# EAGLE design BB-cape-mitered-0603 (EAGLE 6.4)
DATABASE: ./../BOM/logic-supply-db.txt
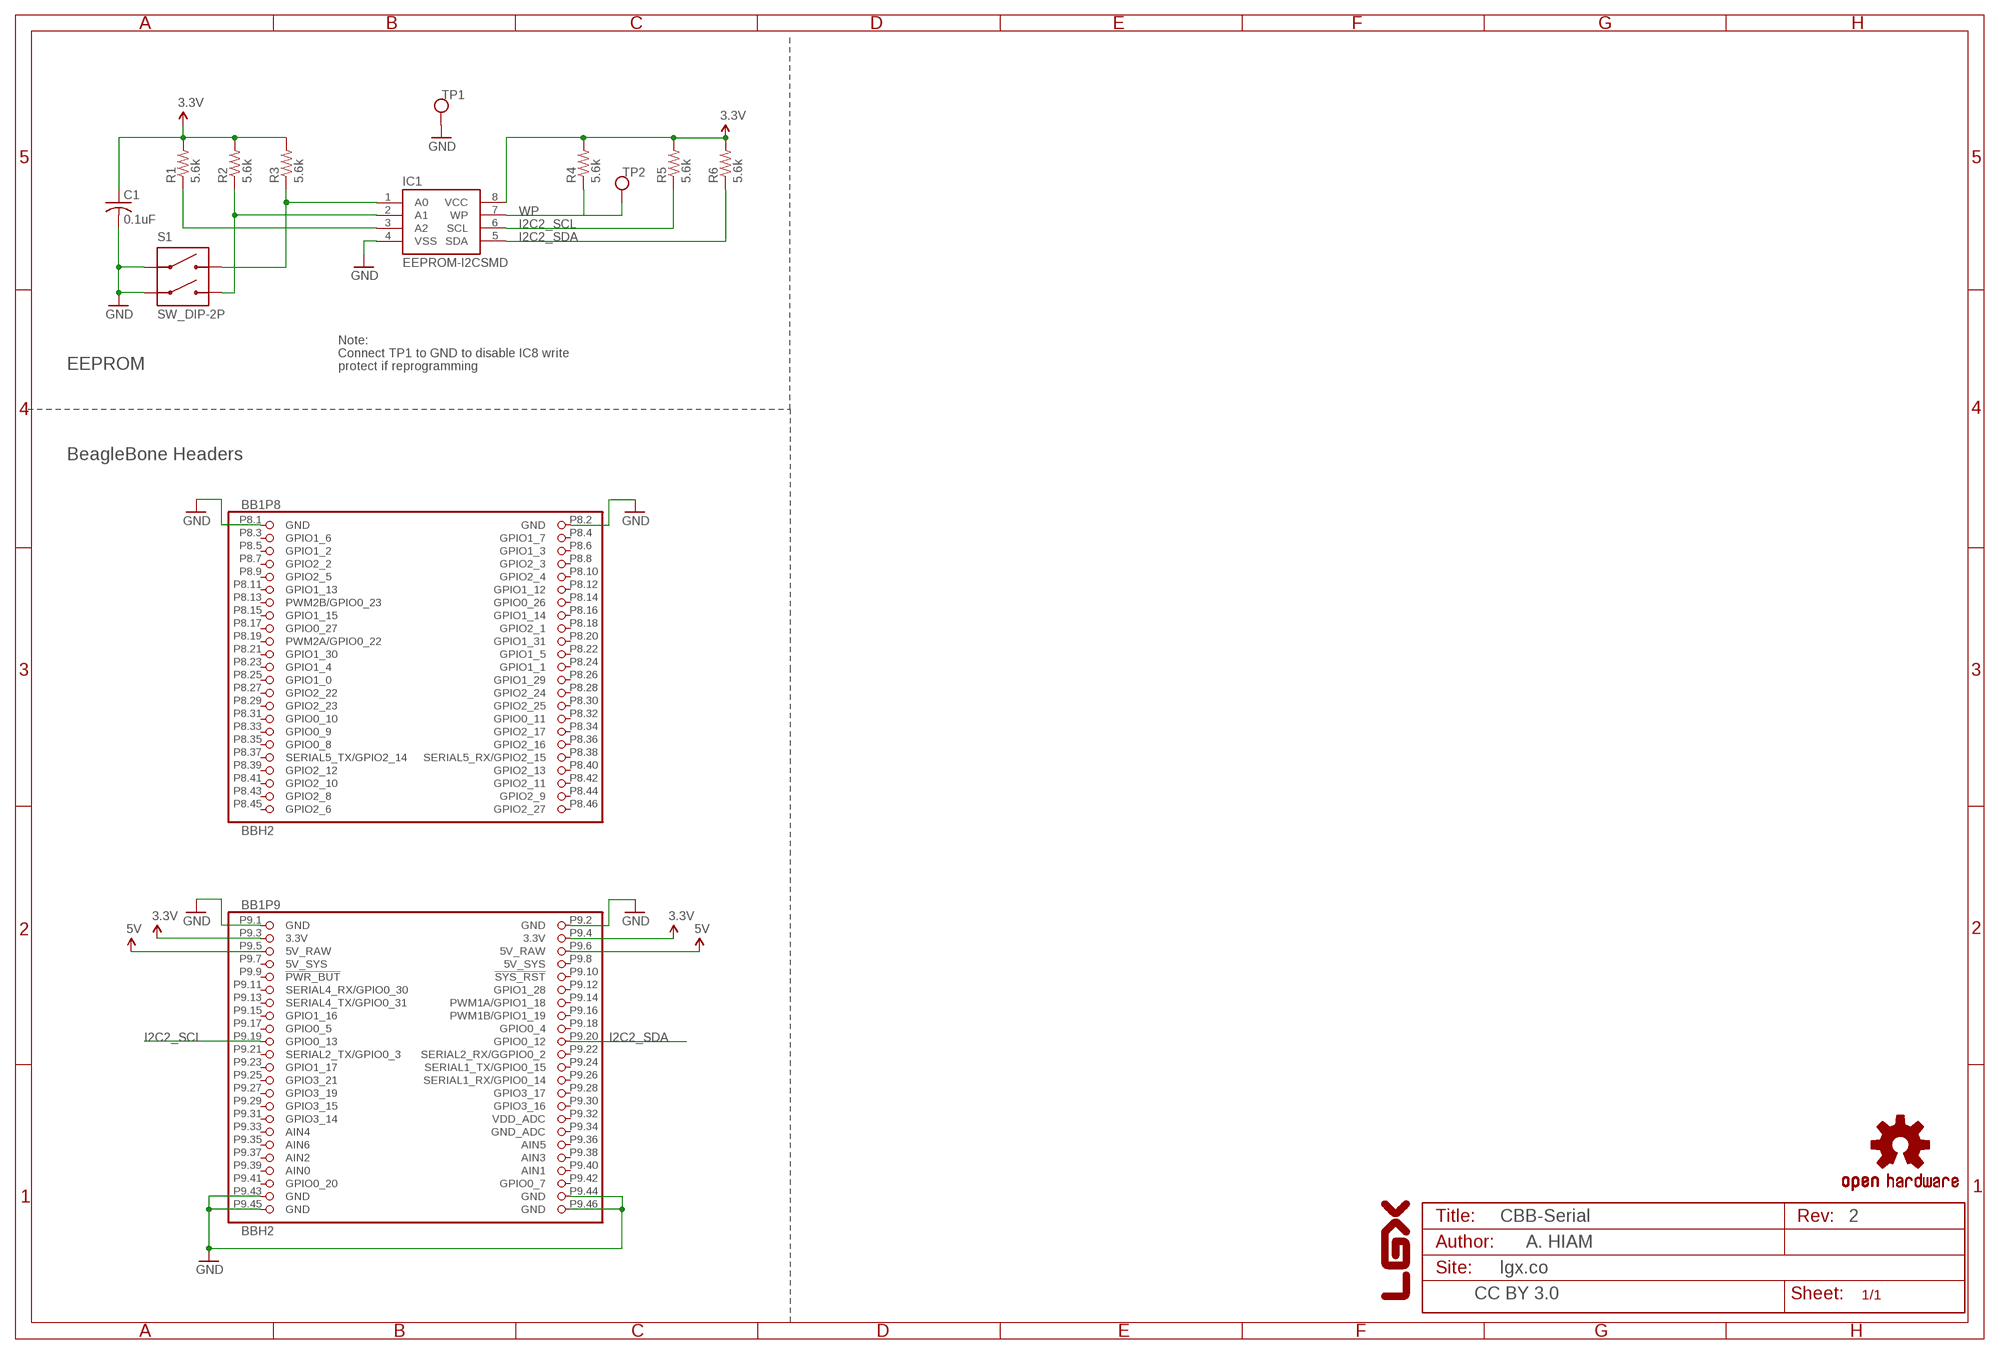
[diagram p0: schematic, sheet 1]

## Parts
BB1  BBH2  [BB_CAPE_TOP]
C1  0.1uF  C-USC0603  [C0603]
IC1  EEPROM-I2CSMD  [SO08]
R1  5.6k  R-US_R0603  [R0603]
R2  5.6k  R-US_R0603  [R0603]
R3  5.6k  R-US_R0603  [R0603]
R4  5.6k  R-US_R0603  [R0603]
R5  5.6k  R-US_R0603  [R0603]
R6  5.6k  R-US_R0603  [R0603]
S1  SW_DIP-2P  [DIPSWITCH-2P-SMD-1.27]
TP1  TEST_POINT  [TEST_POINT]
TP2  TEST_POINT  [TEST_POINT]
U$4  LOGO-LGX_LARGE  [LOGO-LGX-LARGE]
U$7  OSHW-LOGOM  [OSHW-LOGO-M]

## Nets
3.3V: BB1.P9.3(P9:3.3V) BB1.P9.4(P9:3.3V) C1.1 IC1.8(VCC) R1.2 R2.2 R3.2 R4.2 R5.2 R6.2
5V: BB1.P9.5(P9:5V_RAW) BB1.P9.6(P9:5V_RAW)
GND: BB1.P8.1(P8:GND) BB1.P8.2(P8:GND) BB1.P9.1(P9:GND) BB1.P9.2(P9:GND) BB1.P9.43(P9:GND) BB1.P9.44(P9:GND) BB1.P9.45(P9:GND) BB1.P9.46(P9:GND) C1.2 IC1.4(VSS) S1.1A S1.2A TP1.P$1
I2C2_SCL: BB1.P9.19(P9:GPIO0_13) IC1.6(SCL) R5.1
I2C2_SDA: BB1.P9.20(P9:GPIO0_12) IC1.5(SDA) R6.1
N$13: IC1.1(A0) R3.1 S1.1B
N$14: IC1.2(A1) R2.1 S1.2B
N$15: IC1.3(A2) R1.1
WP: IC1.7(WP) R4.1 TP2.P$1
Unconnected: BB1.P8.3(P8:GPIO1_6) BB1.P8.4(P8:GPIO1_7) BB1.P8.5(P8:GPIO1_2) BB1.P8.6(P8:GPIO1_3) BB1.P8.7(P8:GPIO2_2) BB1.P8.8(P8:GPIO2_3) BB1.P8.9(P8:GPIO2_5) BB1.P8.10(P8:GPIO2_4) BB1.P8.11(P8:GPIO1_13) BB1.P8.12(P8:GPIO1_12) BB1.P8.13(P8:PWM2B/GPIO0_23) BB1.P8.14(P8:GPIO0_26) BB1.P8.15(P8:GPIO1_15) BB1.P8.16(P8:GPIO1_14) BB1.P8.17(P8:GPIO0_27) BB1.P8.18(P8:GPIO2_1) BB1.P8.19(P8:PWM2A/GPIO0_22) BB1.P8.20(P8:GPIO1_31) BB1.P8.21(P8:GPIO1_30) BB1.P8.22(P8:GPIO1_5) BB1.P8.23(P8:GPIO1_4) BB1.P8.24(P8:GPIO1_1) BB1.P8.25(P8:GPIO1_0) BB1.P8.26(P8:GPIO1_29) BB1.P8.27(P8:GPIO2_22) BB1.P8.28(P8:GPIO2_24) BB1.P8.29(P8:GPIO2_23) BB1.P8.30(P8:GPIO2_25) BB1.P8.31(P8:GPIO0_10) BB1.P8.32(P8:GPIO0_11) BB1.P8.33(P8:GPIO0_9) BB1.P8.34(P8:GPIO2_17) BB1.P8.35(P8:GPIO0_8) BB1.P8.36(P8:GPIO2_16) BB1.P8.37(P8:SERIAL5_TX/GPIO2_14) BB1.P8.38(P8:SERIAL5_RX/GPIO2_15) BB1.P8.39(P8:GPIO2_12) BB1.P8.40(P8:GPIO2_13) BB1.P8.41(P8:GPIO2_10) BB1.P8.42(P8:GPIO2_11) BB1.P8.43(P8:GPIO2_8) BB1.P8.44(P8:GPIO2_9) BB1.P8.45(P8:GPIO2_6) BB1.P8.46(P8:GPIO2_27) BB1.P9.9(P9:!PWR_BUT) BB1.P9.10(P9:!SYS_RST) BB1.P9.11(P9:SERIAL4_RX/GPIO0_30) BB1.P9.12(P9:GPIO1_28) BB1.P9.13(P9:SERIAL4_TX/GPIO0_31) BB1.P9.14(P9:PWM1A/GPIO1_18) BB1.P9.15(P9:GPIO1_16) BB1.P9.16(P9:PWM1B/GPIO1_19) BB1.P9.17(P9:GPIO0_5) BB1.P9.18(P9:GPIO0_4) BB1.P9.21(P9:SERIAL2_TX/GPIO0_3) BB1.P9.22(P9:SERIAL2_RX/GGPIO0_2) BB1.P9.23(P9:GPIO1_17) BB1.P9.24(P9:SERIAL1_TX/GPIO0_15) BB1.P9.25(P9:GPIO3_21) BB1.P9.26(P9:SERIAL1_RX/GPIO0_14) BB1.P9.27(P9:GPIO3_19) BB1.P9.28(P9:GPIO3_17) BB1.P9.29(P9:GPIO3_15) BB1.P9.30(P9:GPIO3_16) BB1.P9.31(P9:GPIO3_14) BB1.P9.32(P9:VDD_ADC) BB1.P9.33(P9:AIN4) BB1.P9.34(P9:GND_ADC) BB1.P9.35(P9:AIN6) BB1.P9.36(P9:AIN5) BB1.P9.37(P9:AIN2) BB1.P9.38(P9:AIN3) BB1.P9.39(P9:AIN0) BB1.P9.40(P9:AIN1) BB1.P9.41(P9:GPIO0_20) BB1.P9.42(P9:GPIO0_7)

## Notes on the sheet
- Note:
- Connect TP1 to GND to disable IC8 write
- EEPROM | protect if reprogramming
- BeagleBone Headers
- CBB-Serial | 2
- A. HIAM
- lgx.co
- CC BY 3.0

## Power pins joined to a net without a drawn wire
5V_SYS: BB1.P9.7(P9:5V_SYS) BB1.P9.8(P9:5V_SYS)

## Library data of the parts
BB1 = logic-supply:BBH: BeagleBone header sub-assembly BBH1 outdated, use BBH2 or BBH3 only
C1 = rcl:C-US: CAPACITOR, American symbol; PARTNO: C1608X7R1E104K080AA
IC1 = logic-supply:EEPROM-I2C: I2C EEPROM chips, 24LC256 (and others); PARTNO: CAT24C256WI
R1-R6 = rcl:R-US_: RESISTOR, American symbol; PARTNO: RC0603FR-074K7L
S1 = logic-supply:SW_DIP-2P; PARTNO: EHS102LD
TP1 TP2 = logic-supply:TEST_POINT; BOM: EXCLUDE
U$4 = logic-supply:LOGO-LGX
U$7 = logic-supply:OSHW-LOGO: Open Source Hardware Logo This logo indicates the piece of hardware it is found on incorporates a OSHW license and/or adheres to the definition of open source hardware found here: http://freedomdefined.org/OSHW

## Board
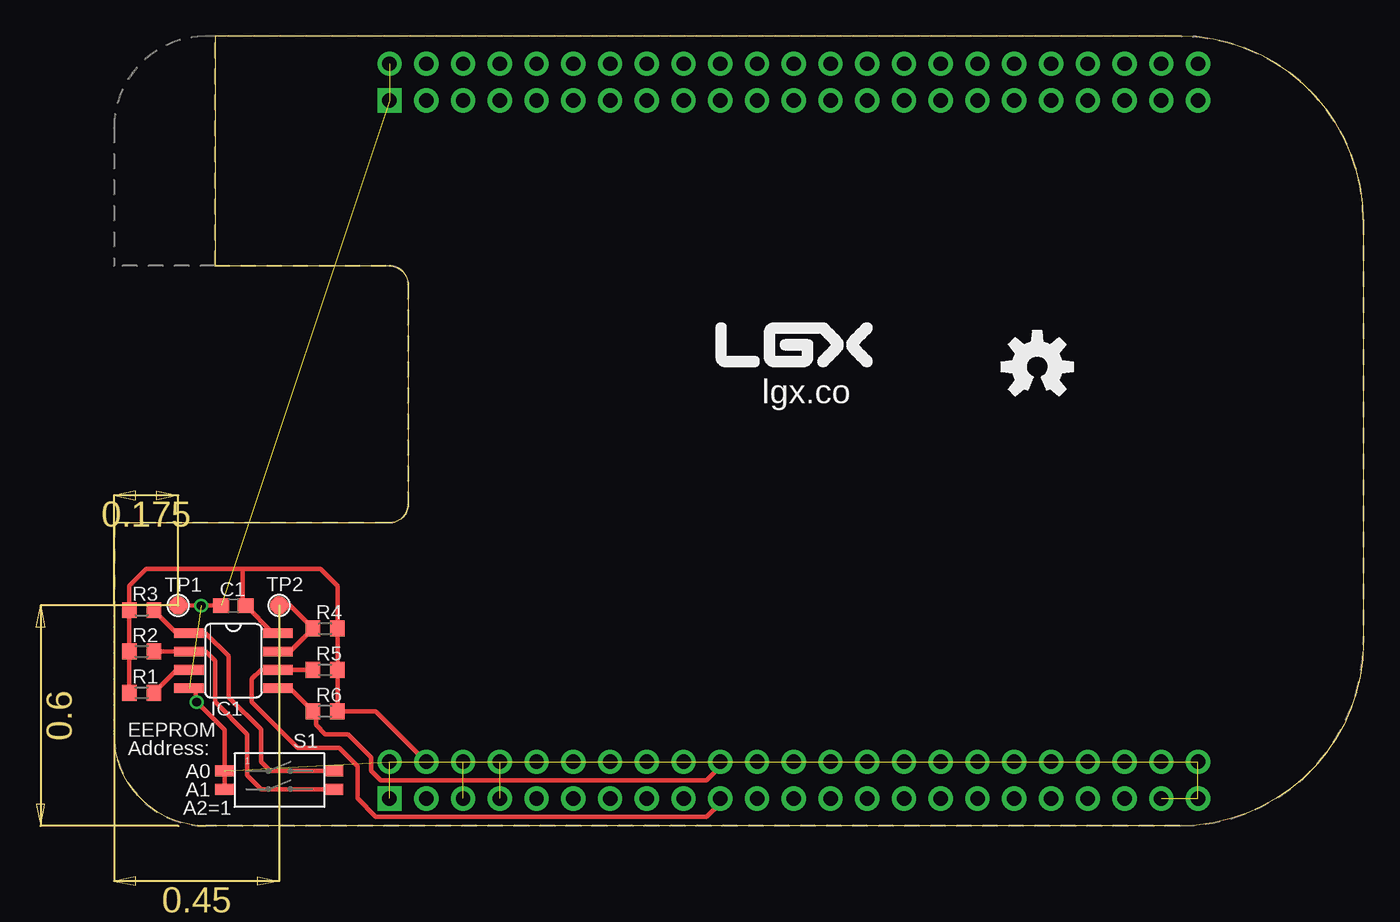
[diagram p1: board, top side]
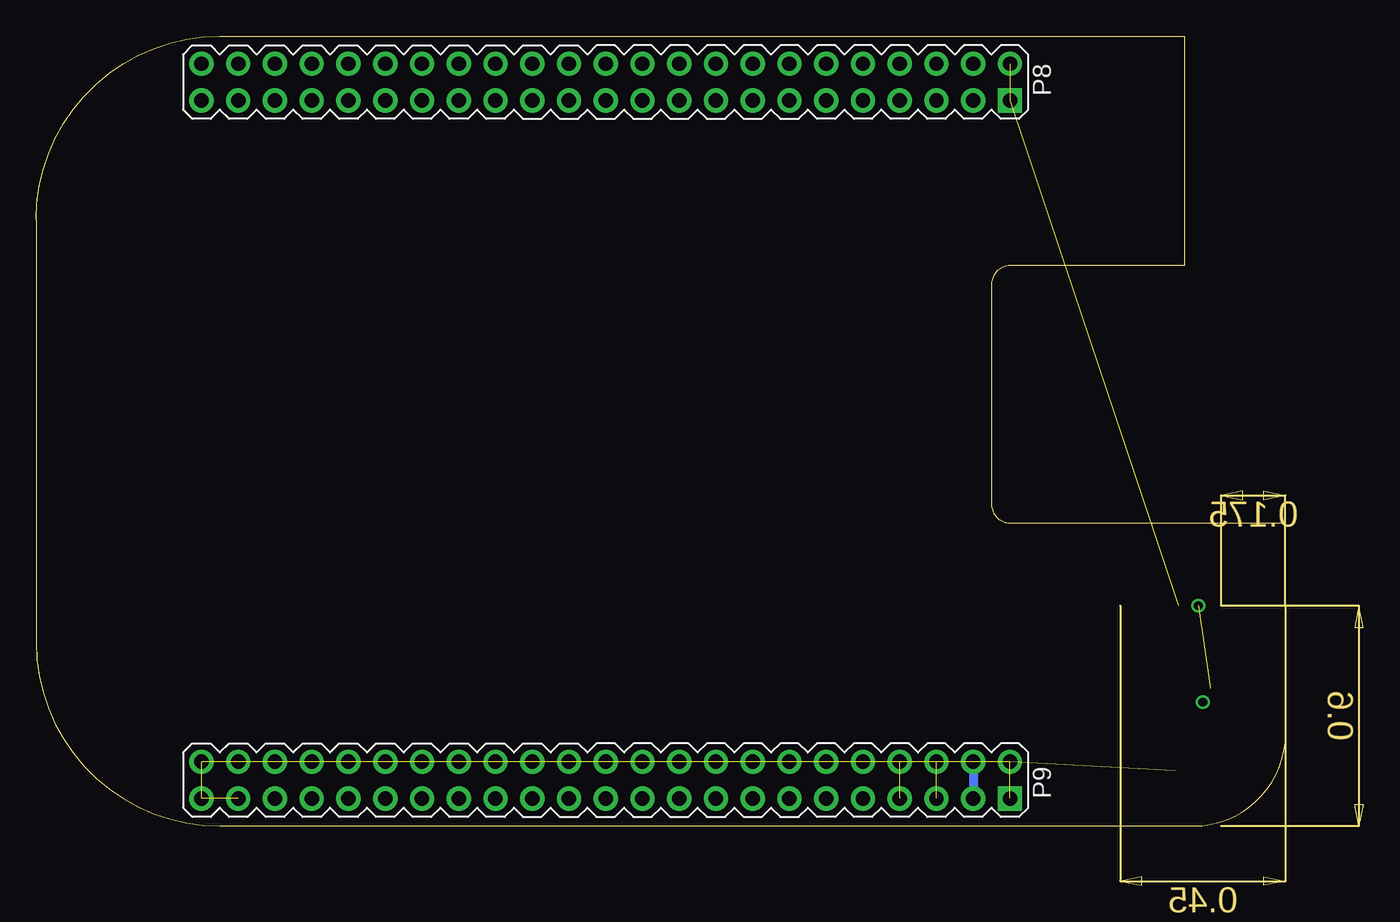
[diagram p2: board, bottom side, seen from below]

Size 86.36 x 54.61 mm. Coordinates in mm from the lower left corner, seen from the top.
Outline: 86.36,41.91 86.36,12.7 arc-90 73.66,0 6.35,0 arc-90 0,6.35 0,20.95 19.05,20.95 arc90 20.32,22.23 20.32,37.47 arc90 19.05,38.73 6.99,38.73 6.99,54.61 73.66,54.61 arc-90 86.36,41.91
Copper layers (1*16): Top 0.0356mm / dielectric 1.5011mm / Bottom 0.0356mm
Design rules "LaenPCBOrder": minimum track width 6mil, minimum drill 13mil, track to track 6mil, track to pad 6mil, pad to pad 6mil, via to via 6mil, smd to smd 6mil, copper to edge 15mil, drill to drill 6mil, minimum pad ring 7mil, minimum via ring 7mil, stop-mask expansion 4mil, vias tented up to drill 0mil, thermal gap 10mil

### Footprints (pad centres in the part's own frame; a part is rotated, then mirrored left to right if it is on the bottom)
BB_CAPE_TOP = drill 1 pad 1.676 square: P8.1 50.165,19.05; P9.1 1.905,19.05 | drill 1 pad 1.676: P8.2 52.705,19.05; P8.3 50.165,21.59; P8.4 52.705,21.59; P8.5 50.165,24.13; P8.6 52.705,24.13; P8.7 50.165,26.67; P8.8 52.705,26.67; P8.9 50.165,29.21; P8.10 52.705,29.21; P8.11 50.165,31.75; P8.12 52.705,31.75; P8.13 50.165,34.29; P8.14 52.705,34.29; P8.15 50.165,36.83; P8.16 52.705,36.83; P8.17 50.165,39.37; P8.18 52.705,39.37; P8.19 50.165,41.91; P8.20 52.705,41.91; P8.21 50.165,44.45; P8.22 52.705,44.45; P8.23 50.165,46.99; P8.24 52.705,46.99; P8.25 50.165,49.53; P8.26 52.705,49.53; P8.27 50.165,52.07; P8.28 52.705,52.07; P8.29 50.165,54.61; P8.30 52.705,54.61; P8.31 50.165,57.15; P8.32 52.705,57.15; P8.33 50.165,59.69; P8.34 52.705,59.69; P8.35 50.165,62.23; P8.36 52.705,62.23; P8.37 50.165,64.77; P8.38 52.705,64.77; P8.39 50.165,67.31; P8.40 52.705,67.31; P8.41 50.165,69.85; P8.42 52.705,69.85; P8.43 50.165,72.39; P8.44 52.705,72.39; P8.45 50.165,74.93; P8.46 52.705,74.93; P9.2 4.445,19.05; P9.3 1.905,21.59; P9.4 4.445,21.59; P9.5 1.905,24.13; P9.6 4.445,24.13; P9.7 1.905,26.67; P9.8 4.445,26.67; P9.9 1.905,29.21; P9.10 4.445,29.21; P9.11 1.905,31.75; P9.12 4.445,31.75; P9.13 1.905,34.29; P9.14 4.445,34.29; P9.15 1.905,36.83; P9.16 4.445,36.83; P9.17 1.905,39.37; P9.18 4.445,39.37; P9.19 1.905,41.91; P9.20 4.445,41.91; P9.21 1.905,44.45; P9.22 4.445,44.45; P9.23 1.905,46.99; P9.24 4.445,46.99; P9.25 1.905,49.53; P9.26 4.445,49.53; P9.27 1.905,52.07; P9.28 4.445,52.07; P9.29 1.905,54.61; P9.30 4.445,54.61; P9.31 1.905,57.15; P9.32 4.445,57.15; P9.33 1.905,59.69; P9.34 4.445,59.69; P9.35 1.905,62.23; P9.36 4.445,62.23; P9.37 1.905,64.77; P9.38 4.445,64.77; P9.39 1.905,67.31; P9.40 4.445,67.31; P9.41 1.905,69.85; P9.42 4.445,69.85; P9.43 1.905,72.39; P9.44 4.445,72.39; P9.45 1.905,74.93; P9.46 4.445,74.93
C0603 = smd 1.1 x 1: 1 -0.85,0; 2 0.85,0
SO08 = smd 0.66 x 2.032: 1 -1.905,-3.073; 2 -0.635,-3.073; 3 0.635,-3.073; 4 1.905,-3.073; 5 1.905,3.073; 6 0.635,3.073; 7 -0.635,3.073; 8 -1.905,3.073
R0603 = smd 1 x 1.1: 1 -0.85,0; 2 0.85,0
DIPSWITCH-2P-SMD-1.27 = smd 1.3 x 0.76: 1A -3.775,0.635; 1B 3.775,0.635; 2A -3.775,-0.635; 2B 3.775,-0.635
TEST_POINT = smd 1.27 x 1.27: P$1 0,0

### Placement (x,y rotation side)
BB1  0,0 90 bottom
C1  8.26,15.24 180 top
IC1  8.26,11.43 270 top
R1  1.91,9.21 180 top
R2  1.91,12.06 180 top
R3  1.91,14.92 180 top
R4  14.61,13.65 0 top
R5  14.61,10.79 0 top
R6  14.61,7.94 0 top
S1  11.43,3.17 0 top
TP1  4.45,15.24 0 top
TP2  11.43,15.24 0 top
U$4  41.59,31.75 0 top
U$7  63.82,31.75 0 top

### Tracks (layer width: path | path; a pad name or v marks a point on that pad's centre or on a via)
3.3V
  Top 0.305: R1.2 R2.2 R3.2 1.05,16.61 2.22,17.78 8.89,17.78 | 11.53,13.36 IC1.8 11.01,13.34 C1.1 8.89,15.24 8.89,17.78 | 8.89,17.78 14.29,17.78 15.46,16.61 R4.2 15.46,13.34 R5.2 R6.2 18.1,7.94 BB1.P9.4
  Bottom 0.61: BB1.P9.4 BB1.P9.3
5V  (1 unrouted)
5V_SYS  (1 unrouted)
GND  (via drill 0.6)  (9 unrouted)
  Top 0.305: S1.2A S1.1A 7.66,6.63 v5.71,8.57 5.64,8.65 5.64,9.45 IC1.4 | C1.2 v6.03,15.24 TP1.P$1
I2C2_SCL
  Top 0.305: R5.1 IC1.6 10.16,10.79 9.53,10.16 9.53,8.57 12.7,5.4 15.56,5.4 16.83,4.13 16.83,1.91 18.1,0.64 40.96,0.64 41.91,1.59 BB1.P9.19
I2C2_SDA
  Top 0.305: BB1.P9.20 41.91,4.13 40.96,3.17 18.41,3.17 17.78,3.81 17.78,4.76 16.19,6.35 14.61,6.35 13.97,6.99 13.97,7.72 R6.1 12.17,9.53 IC1.5
N$13
  Top 0.305: R3.1 4.34,13.34 IC1.1 6.35,13.34 7.94,11.75 7.94,8.89 10.16,6.67 10.16,4.45 10.79,3.81 S1.1B
N$14
  Top 0.305: R2.1 IC1.2 6.35,12.06 6.99,11.43 6.99,8.57 9.21,6.35 9.21,3.49 10.16,2.54 S1.2B
N$15
  Top 0.305: IC1.3 4.34,10.79 R1.1
WP
  Top 0.305: TP2.P$1 12.17,15.24 R4.1 12.17,12.06 IC1.7

### Text on the board
tPlace: lgx.co | EEPROM | Address: | A0 | A1 | A2=1